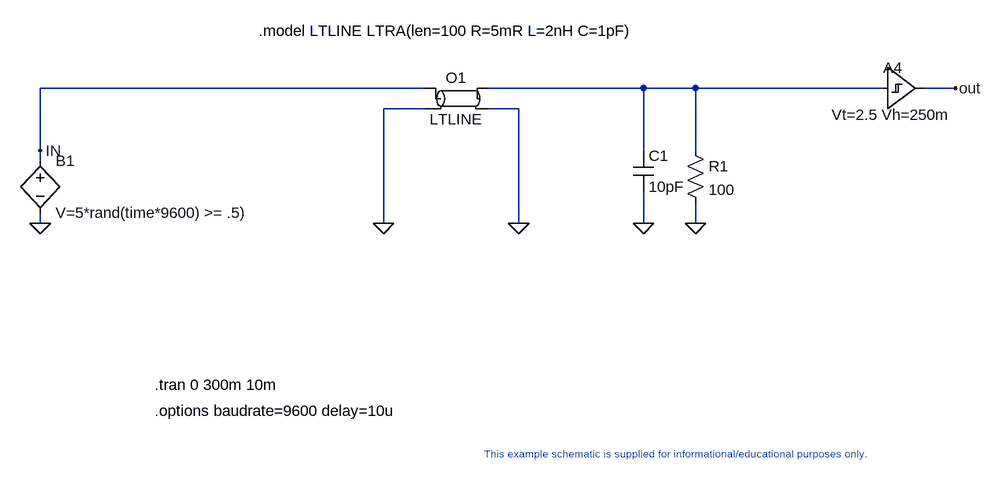
[diagram p0: schematic WE-RS232-LINE-Eye-Diagram.asc]
WE-RS232-LINE-Eye-Diagram.asc, the LTspice schematic file:
Version 4
SHEET 1 1812 1620
WIRE 192 784 -400 784
WIRE 528 784 288 784
WIRE 608 784 528 784
WIRE 896 784 608 784
WIRE 1008 784 960 784
WIRE 192 816 128 816
WIRE 336 816 288 816
WIRE -400 880 -400 784
WIRE 528 880 528 784
WIRE 608 880 608 784
WIRE -400 896 -400 880
WIRE -400 992 -400 976
WIRE 128 992 128 816
WIRE 336 992 336 816
WIRE 528 992 528 944
WIRE 608 992 608 960
FLAG -400 992 0
FLAG -400 880 IN
FLAG 1008 784 out
FLAG 128 992 0
FLAG 528 992 0
FLAG 608 992 0
FLAG 336 992 0
SYMBOL DIGITAL\\SCHMTBUF 896 720 R0
WINDOW 0 1 33 Left 2
WINDOW 3 12 105 Center 2
SYMATTR InstName A4
SYMATTR Value Vt=2.5 Vh=250m
SYMBOL BV -400 880 R0
SYMATTR InstName B1
SYMATTR Value V=5*rand(time*9600) >= .5)
SYMBOL ltline 240 800 R0
SYMATTR InstName O1
SYMATTR Value LTLINE
SYMBOL res 592 864 R0
SYMATTR InstName R1
SYMATTR Value 100
SYMBOL cap 512 880 R0
SYMATTR InstName C1
SYMATTR Value 10pF
TEXT -224 1240 Left 2 !.tran 0 300m 10m
TEXT -224 1280 Left 2 !.options baudrate=9600 delay=10u
TEXT 568 1336 Top 1 ;This example schematic is supplied for informational/educational purposes only.
TEXT -64 696 Left 2 !.model LTLINE LTRA(len=100 R=5mR L=2nH C=1pF)

The netlist it stands for:
* WE-RS232-LINE-Eye-Diagram.asc
A4 N001 0 0 0 0 0 out 0 SCHMITT Vt=2.5 Vh=250m
B1 IN 0 V=5*rand(time*9600) >= .5)
O1 IN 0 N001 0 LTLINE
R1 N001 0 100
C1 N001 0 10pF
.tran 0 300m 10m
.options baudrate=9600 delay=10u
* This example schematic is supplied for informational/educational purposes only.
.model LTLINE LTRA(len=100 R=5mR L=2nH C=1pF)
.backanno
.end